# Altium schematic sheet temp_measure.SchDoc
size A; SheetNumber: 11; SheetTotal: 12
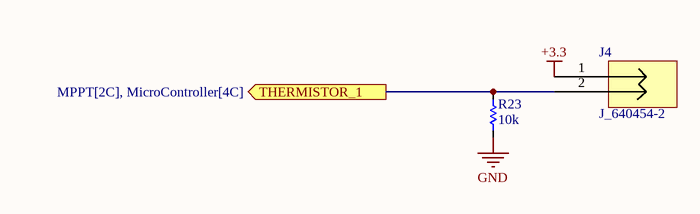
[diagram p0: temp_measure.SchDoc]

## Parts
J4  J_640454-2  [640454-2]
R23  value 10k  [0603_RESISTOR]  (hidden comment: Res 0603 10K ohm 1%)

## Ports
THERMISTOR_1 (out, see MPPT[2C], MicroController[4C])

## Nets
+3.3: J4.1
GND: R23.1
THERMISTOR_1: J4.2 R23.2 ; port THERMISTOR_1

## Library data of the parts
J4 = CMP-009-000000-4: 2 Positions Header, Unshrouded Connector 0.100" (2.54mm) Through Hole Tin; Max Current Rating: 2A; Gender: Male; Pins: 2; Mounting Technology: TH
R23 = CMP-058-000017-6: RES 10K OHM 1/16W 1% 0603 SMD; Power: 62.5mW; Pins: 2; Case/Package: 0603; Tolerance: 1%; Mounting Technology: SMD